# Altium schematic sheet USB_OTG_HS.SchDoc
size A4; Revision: C.2(PCB.SCH)
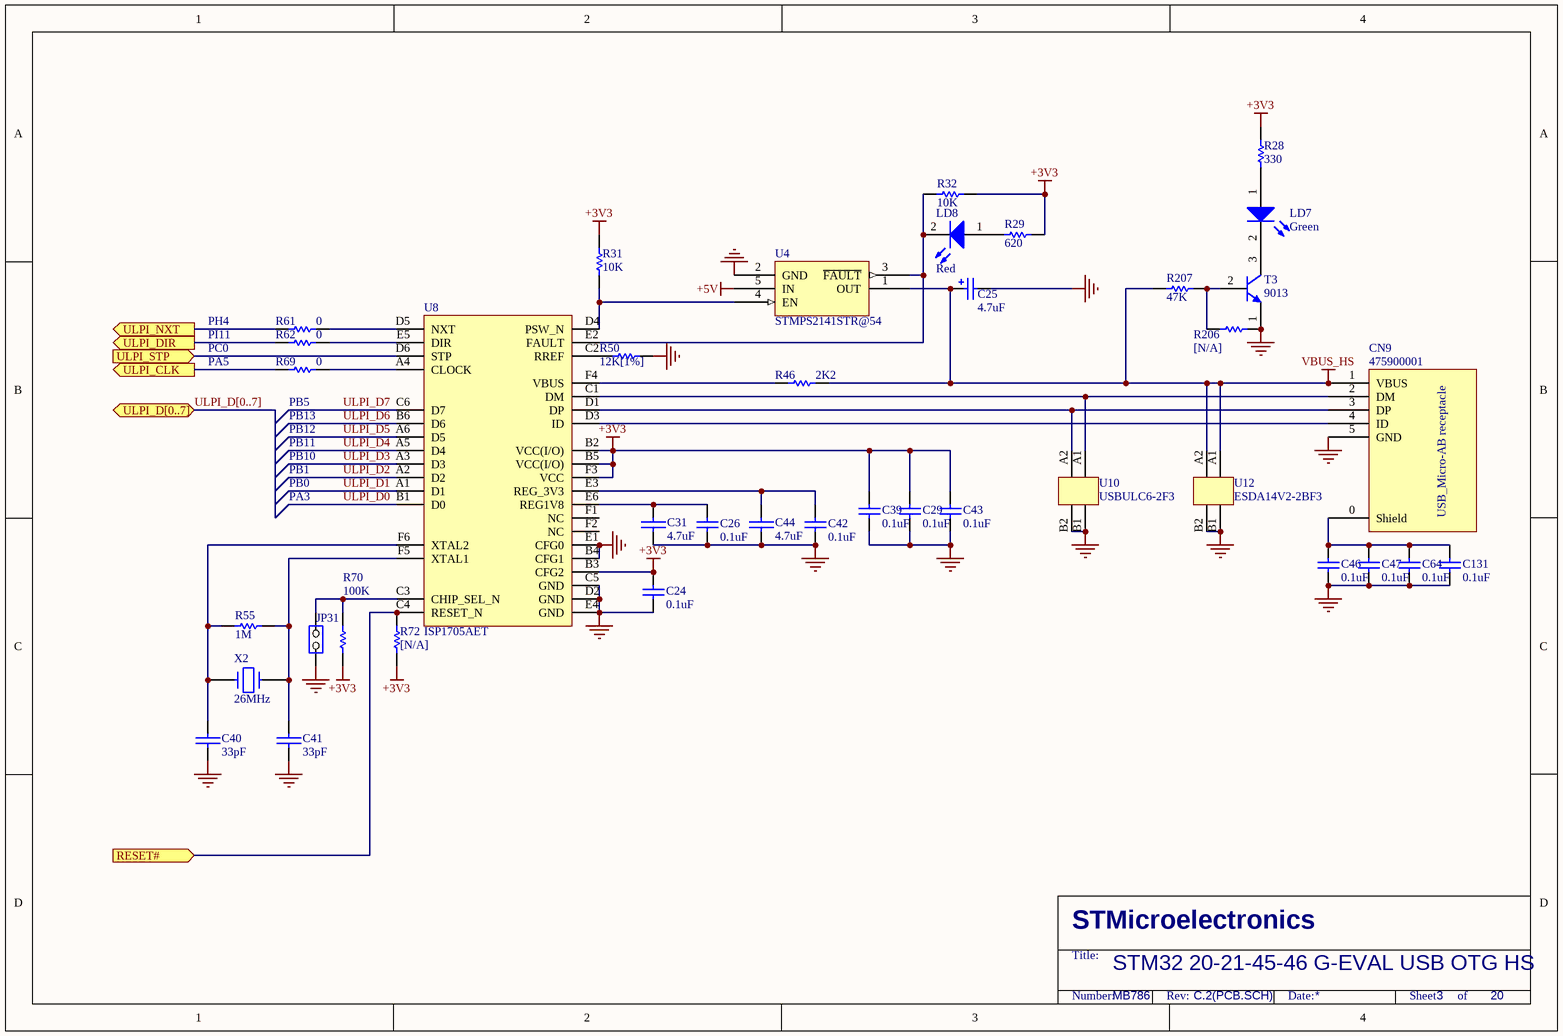
[diagram p0: USB_OTG_HS.SchDoc]

## Parts
C24  0.1uF  [0402C]
C25  4.7uF  [TAN-A]
C26  0.1uF  [0402C]
C29  0.1uF  [0402C]
C31  4.7uF  [TAN-A]
C39  0.1uF  [0402C]
C40  33pF  [0603C]
C41  33pF  [0603C]
C42  0.1uF  [0402C]
C43  0.1uF  [0402C]
C44  4.7uF  [TAN-A]
C46  0.1uF  [0402C]
C47  0.1uF  [0402C]
C64  0.1uF  [0402C]
C131  0.1uF  [0402C]
CN9  475900001  [USB-MICRO-AB]
JP31  (no value)  [SIP2]
LD7  Green  [0603D]
LD8  Red  [0603D]
R28  330  [0603R]
R29  620  [0603R]
R31  10K  [0402R]
R32  10K  [0402R]
R46  2K2  [0603R]
R50  12K[1%]  [0603R]
R55  1M  [0603R]
R61  0  [0603R]
R62  0  [0603R]
R69  0  [0603R]
R70  100K  [0402R]
R72  [N/A]  [0402R]
R206  [N/A]  [0603R]
R207  47K  [0402R]
T3  9013  [SOT-23]
U4  STMPS2141STR@54  [SOT-23-5L]
U8  ISP1705AET  [TFBGA36]
U10  USBULC6-2F3
U12  ESDA14V2-2BF3
X2  26MHz  [XTAL1]

## Ports
RESET# (in), ULPI_CLK (out), ULPI_D[0..7] (bidir), ULPI_DIR (out), ULPI_NXT (out), ULPI_STP (in)

## Nets
+3V3: C24.2 C29.1 C39.1 C43.1 R28.2 R29.2 R31.1 R32.1 R70.1 R72.1 U8.B2(VCC(I/O)) U8.B3(CFG2) U8.B5(VCC(I/O)) U8.F3(VCC)
+5V: U4.5(IN)
GND: C24.1 C25.2 C26.2 C29.2 C31.2 C39.2 C40.2 C41.2 C42.2 C43.2 C44.2 C46.2 C47.2 C64.2 C131.2 CN9.5(GND) JP31.1(COMMON) R50.1 R206.1 T3.1(E) U4.2(GND) U8.B4(CFG1) U8.C5(GND) U8.D2(GND) U8.E1(CFG0) U8.E4(GND) U10.B1 U10.B2 U12.B1 U12.B2
VBUS_HS: C25.1 CN9.1(VBUS) R46.2 R207.2 U4.1(OUT) U12.A1 U12.A2
RESET#: R72.2 U8.C4(RESET_N) ; port RESET#
ULPI_CLK: R69.1 ; port ULPI_CLK
ULPI_D0: U8.B1(D0)
ULPI_D1: U8.A1(D1)
ULPI_D2: U8.A2(D2)
ULPI_D3: U8.A3(D3)
ULPI_D4: U8.A5(D4)
ULPI_D5: U8.A6(D5)
ULPI_D6: U8.B6(D6)
ULPI_D7: U8.C6(D7)
ULPI_DIR: R62.1 ; port ULPI_DIR
ULPI_NXT: R61.1 ; port ULPI_NXT
ULPI_STP: U8.D6(STP) ; port ULPI_STP
NetC26_1: C26.1 C31.1 U8.E6(REG1V8)
NetC40_1: C40.1 R55.1 U8.F6(XTAL2) X2.2
NetC41_1: C41.1 R55.2 U8.F5(XTAL1) X2.1
NetC42_1: C42.1 C44.1 U8.E3(REG_3V3)
NetC46_1: C46.1 C47.1 C64.1 C131.1 CN9.0(Shield)
NetCN9_2: CN9.2(DM) U8.C1(DM) U10.A1
NetCN9_3: CN9.3(DP) U8.D1(DP) U10.A2
NetCN9_4: CN9.4(ID) U8.D3(ID)
NetJP31_2: JP31.2(NO) R70.2 U8.C3(CHIP_SEL_N)
NetLD7_1: LD7.1(A) R28.1
NetLD7_2: LD7.2(K) T3.3(C)
NetLD8_1: LD8.1(A) R29.1
NetLD8_2: LD8.2(K) R32.2 U4.3(~{FAULT}) U8.E2(FAULT)
NetR31_2: R31.2 U4.4(EN) U8.D4(PSW_N)
NetR46_1: R46.1 U8.F4(VBUS)
NetR50_2: R50.2 U8.C2(RREF)
NetR61_2: R61.2 U8.D5(NXT)
NetR62_2: R62.2 U8.E5(DIR)
NetR69_2: R69.2 U8.A4(CLOCK)
NetR206_2: R206.2 R207.1 T3.2(B)

Not connected (* = marked no-connect by the designer): U8 F1(NC) F2(NC)

## Buses and harness runs
bus ULPI_D[0..7] = port ULPI_D[0..7]

## Notes on the sheet
- PI11
- PC0
- PH4
- PA5
- PB11
- PB12
- (near R69) PB13
- (near R69) PB5
- PA3
- PB0
- PB1
- PB10
- STM32 20-21-45-46 G-EVAL USB OTG HS
- MB786
- 3
- 20
- STMicroelectronics
- Title:
- Number:
- Rev:
- Date:
- Sheet       of
- (in symbol 475900001) USB_Micro-AB receptacle

## Library data of the parts
C24 C26 C29 C39 C42 C43 C46 C47 C64 C131 = Cap: Capacitor; Value: 10nF; Published: 8-Jun-2000; Revision: July-2002: Re-released for DXP Platform.; Publisher: Altium Limited
C25 = Cap Pol1: Polarized Capacitor (Radial); Value: 47uF; Published: 8-Jun-2000; Revision: July-2002: Re-released for DXP Platform.; Publisher: Altium Limited
C31 C40 C41 C44 = CAP: Capacitor
JP31 = JP2
LD7 LD8 = LED2: Typical RED, GREEN, YELLOW, AMBER GaAs LED; Published: 8-Jun-2000; Revision: July-2002: Re-released for DXP Platform.; Publisher: Altium Limited
R28 R31 R32 R46 R61 R62 R69 R70 R72 R206 R207 = res1: Resistor; Value: 1K; Published: 8-Jun-2000; Revision: July-2002: Re-released for DXP Platform.; Publisher: Altium Limited
R29 R50 R55 = Res1: Resistor; Value: 1K; Published: 8-Jun-2000; Revision: July-2002: Re-released for DXP Platform.; Publisher: Altium Limited
T3 = NPN: NPN Bipolar Transistor; Code - JEDEC: TO-226-AA; Published: 8-Jun-2000; Revision: July-2002: Re-released for DXP Platform.; Publisher: Altium Limited
U4 = STMPS2141STR
X2 = CRYSTAL